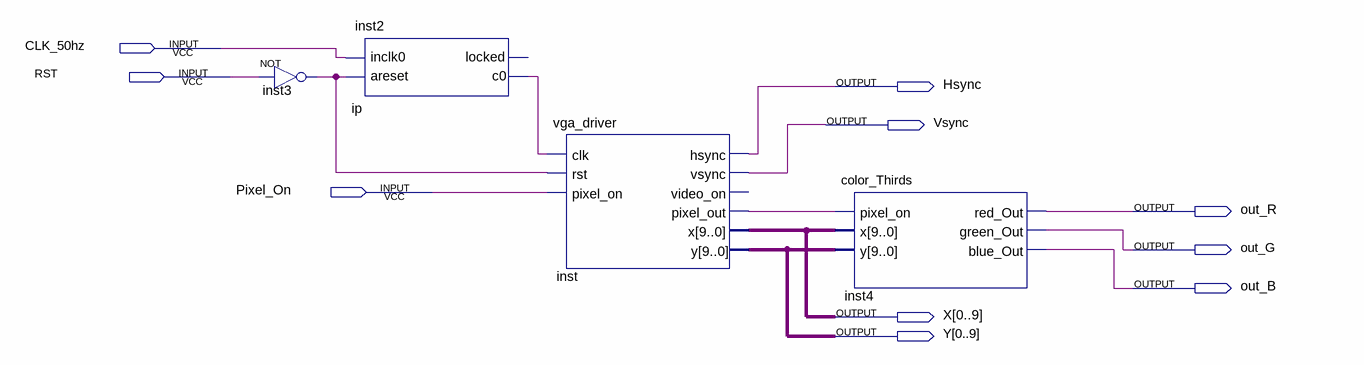
[diagram p0: schematic sheet]
// Quartus schematic VGADriver.bdf as structural Verilog: 4 symbols, 10 pins
module VGADriver (
  input  CLK_50hz,
  input  RST,
  input  Pixel_On,
  output Hsync,
  output Vsync,
  output out_R,
  output out_G,
  output out_B,
  output [0:9] X,
  output [0:9] Y
);

  wire inst2_c0, inst3_out, inst_pixel_out;

  not inst3 (inst3_out, RST);
  ip inst2 (.areset(inst3_out), .inclk0(CLK_50hz), .c0(inst2_c0));  // open: locked
  vga_driver inst (
    .clk(inst2_c0), .rst(inst3_out), .pixel_on(Pixel_On), .hsync(Hsync), .vsync(Vsync),
    .pixel_out(inst_pixel_out), .x(X), .y(Y));  // open: video_on
  color_Thirds inst4 (.pixel_on(inst_pixel_out), .x(X), .y(Y), .red_Out(out_R), .green_Out(out_G), .blue_Out(out_B));
endmodule
